# Altium project PCB_Project.PrjPcb (part 2 of 3)

## Sheet MC60.SchDoc
size A2; SheetNumber: 5; SheetTotal: 8
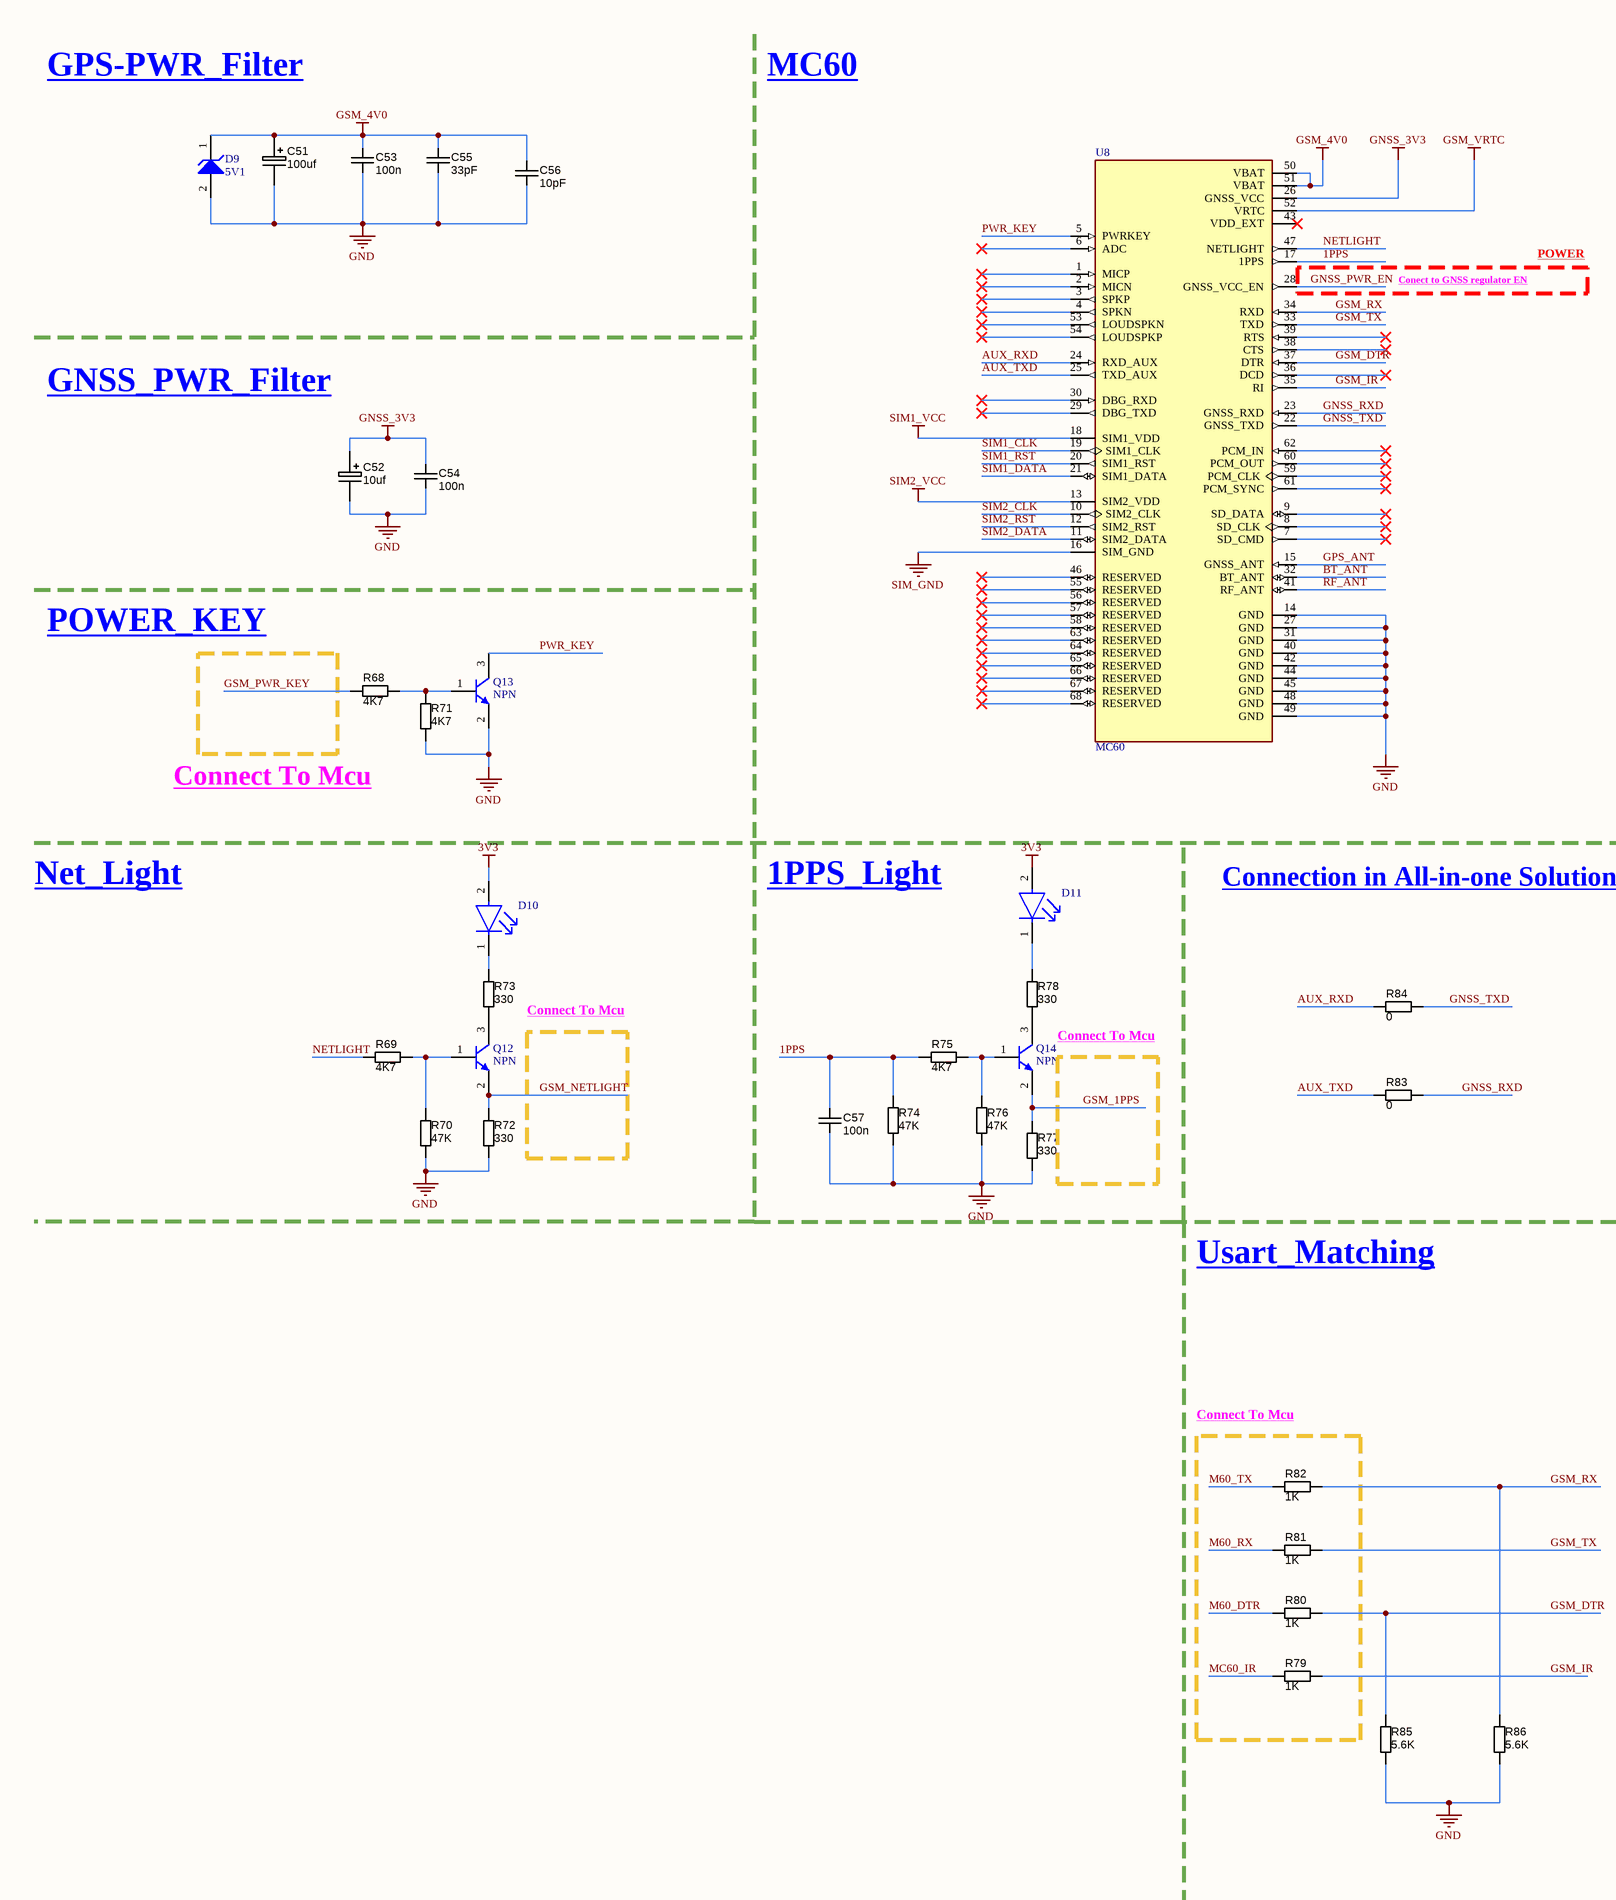
[diagram p4: MC60.SchDoc, left]
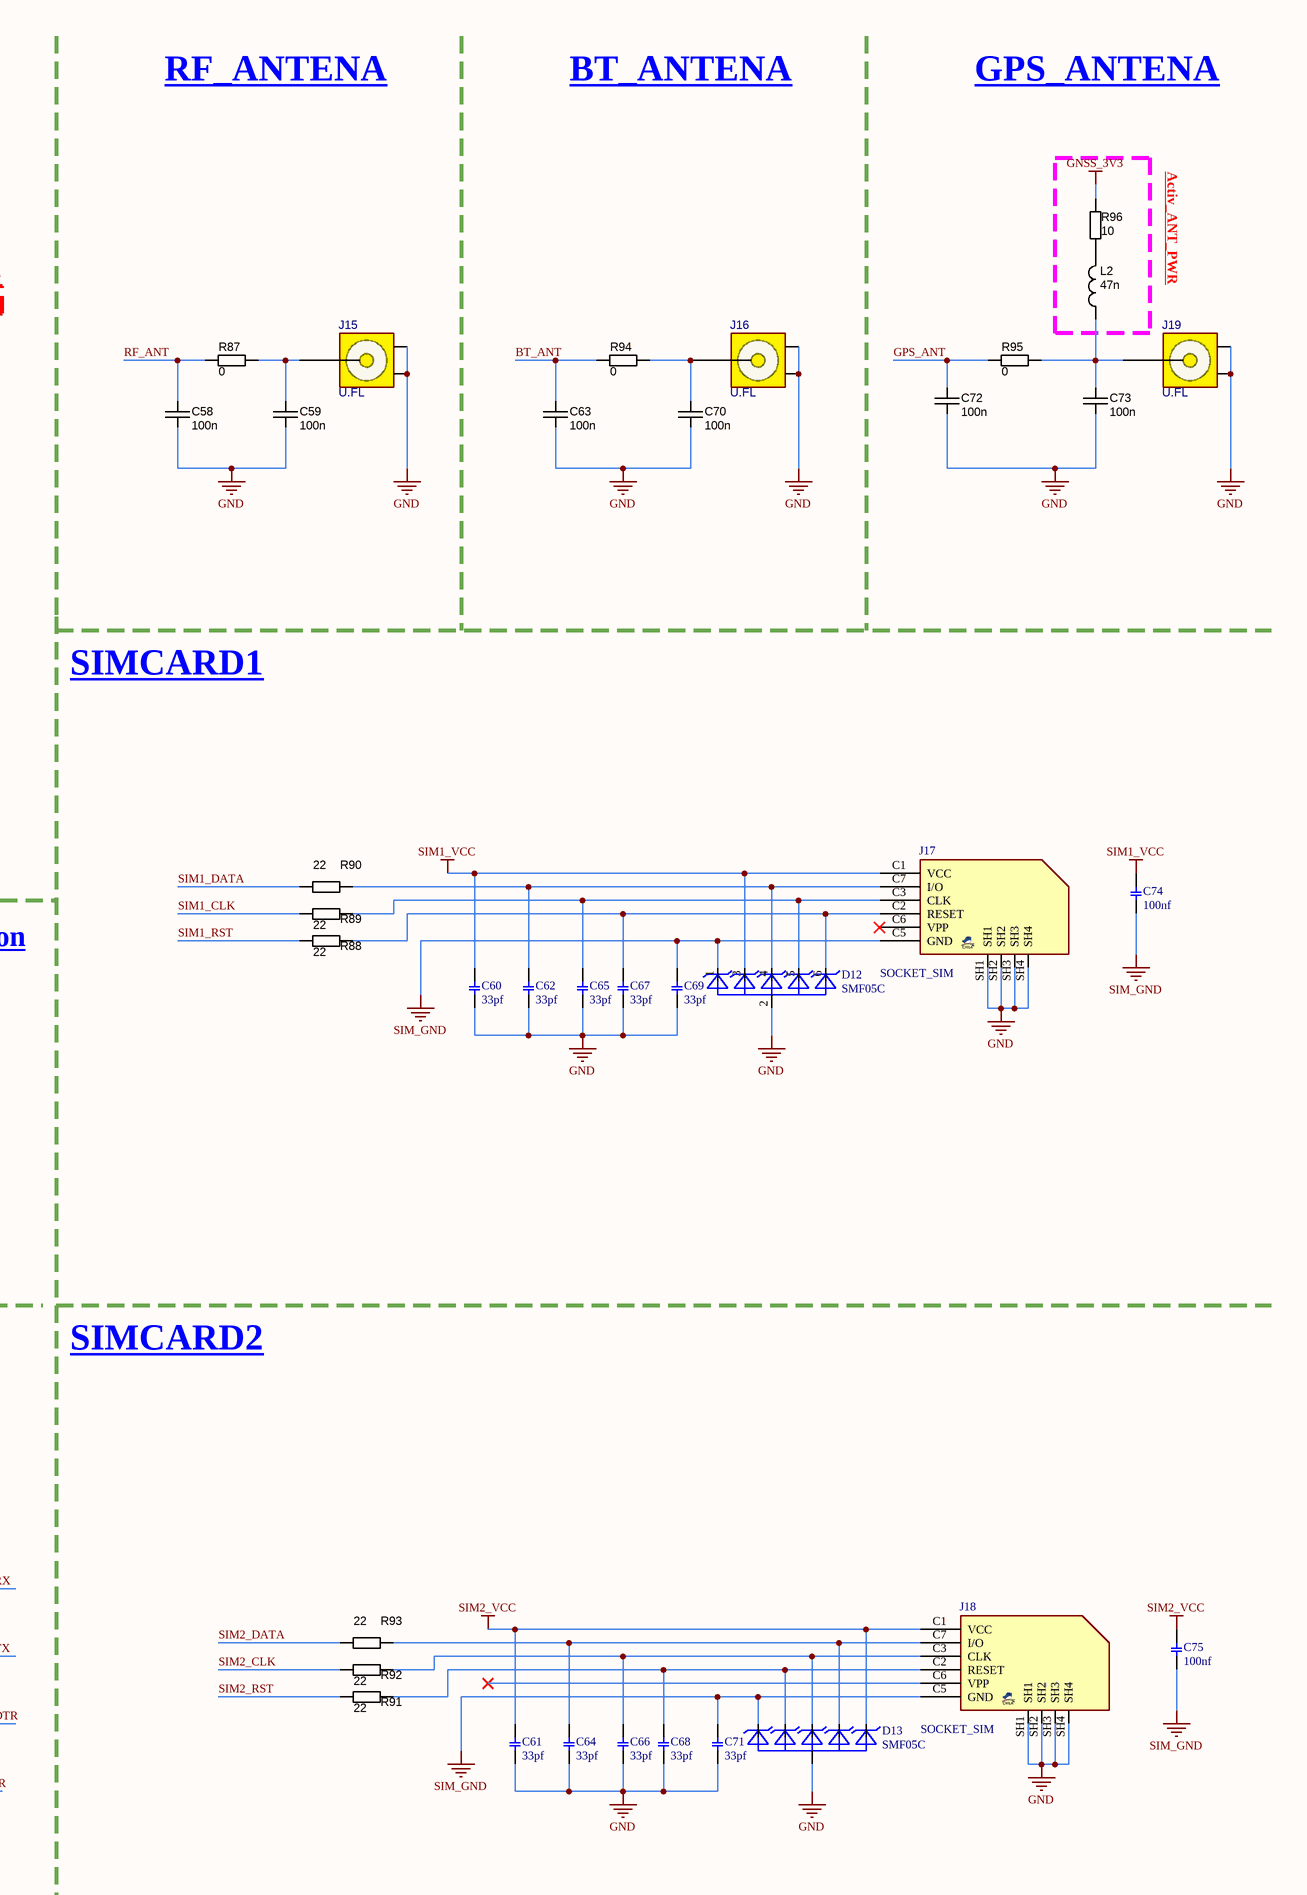
[diagram p5: MC60.SchDoc, right]

### Parts
C51  value 100uf  [C_TN_3528]
C52  value 10uf  [C_TN_3528]
C53  value 100n  [CAPC1608X90N]  (hidden comment: approved sub OK)
C54  value 100n  [CAPC1608X90N]  (hidden comment: approved sub OK)
C55  value 33pF  [CAPC1608X90N]  (hidden comment: approved sub OK)
C56  value 10pF  [CAPC1608X90N]  (hidden comment: approved sub OK)
C57  value 100n  [CAPC1608X90N]  (hidden comment: approved sub OK)
C58  value 100n  [C0402]  (hidden comment: approved sub OK)
C59  value 100n  [C0402]  (hidden comment: approved sub OK)
C60  value 33pf  [0603]  (hidden comment: Capacitor C SMD 0603)
C61  value 33pf  [0603]  (hidden comment: Capacitor C SMD 0603)
C62  value 33pf  [0603]  (hidden comment: Capacitor C SMD 0603)
C63  value 100n  [C0402]  (hidden comment: approved sub OK)
C64  value 33pf  [0603]  (hidden comment: Capacitor C SMD 0603)
C65  value 33pf  [0603]  (hidden comment: Capacitor C SMD 0603)
C66  value 33pf  [0603]  (hidden comment: Capacitor C SMD 0603)
C67  value 33pf  [0603]  (hidden comment: Capacitor C SMD 0603)
C68  value 33pf  [0603]  (hidden comment: Capacitor C SMD 0603)
C69  value 33pf  [0603]  (hidden comment: Capacitor C SMD 0603)
C70  value 100n  [C0402]  (hidden comment: approved sub OK)
C71  value 33pf  [0603]  (hidden comment: Capacitor C SMD 0603)
C72  value 100n  [C0402]  (hidden comment: approved sub OK)
C73  value 100n  [C0402]  (hidden comment: approved sub OK)
C74  value 100nf  [0603]  (hidden comment: Capacitor C SMD 0603)
C75  value 100nf  [0603]  (hidden comment: Capacitor C SMD 0603)
D9  5V1  [ONSC-SMA-2-403D-02_F_V]
D10  LTST-C191TBKT  [FP-LTST-C191TBKT-MFG]  (value not drawn)
D11  LTST-C191TBKT  [FP-LTST-C191TBKT-MFG]  (value not drawn)
D12  SMF05C  [SC70-6]
D13  SMF05C  [SC70-6]
J15  U.FL  [UFL]
J16  U.FL  [UFL]
J17  SOCKET_SIM  [SIM_MICRO_GCT]
J18  SOCKET_SIM  [SIM_MICRO_GCT]
J19  U.FL  [UFL]
L2  47n  [L0603]
Q12  NPN  [SOT23-3]
Q13  NPN  [SOT23-3]
Q14  NPN  [SOT23-3]
R68  value 4K7  [RESC1608X55N]  (hidden comment: Thick Film)
R69  value 4K7  [RESC1608X55N]  (hidden comment: Thick Film)
R70  value 47K  [RESC1608X55N]  (hidden comment: Thick Film)
R71  value 4K7  [RESC1608X55N]  (hidden comment: Thick Film)
R72  value 330  [RESC1608X55N]  (hidden comment: Thick Film)
R73  value 330  [RESC1608X55N]  (hidden comment: Thick Film)
R74  value 47K  [RESC1608X55N]  (hidden comment: Thick Film)
R75  value 4K7  [RESC1608X55N]  (hidden comment: Thick Film)
R76  value 47K  [RESC1608X55N]  (hidden comment: Thick Film)
R77  value 330  [RESC1608X55N]  (hidden comment: Thick Film)
R78  value 330  [RESC1608X55N]  (hidden comment: Thick Film)
R79  value 1K  [RESC1608X55N]  (hidden comment: Thick Film)
R80  value 1K  [RESC1608X55N]  (hidden comment: Thick Film)
R81  value 1K  [RESC1608X55N]  (hidden comment: Thick Film)
R82  value 1K  [RESC1608X55N]  (hidden comment: Thick Film)
R83  value 0  [RESC1608X55N]  (hidden comment: Thick Film)
R84  value 0  [RESC1608X55N]  (hidden comment: Thick Film)
R85  value 5.6K  [RESC1608X55N]  (hidden comment: Thick Film)
R86  value 5.6K  [RESC1608X55N]  (hidden comment: Thick Film)
R87  value 0  [0402]  (hidden comment: Thick Film)
R88  value 22  [RESC1608X55N]  (hidden comment: Thick Film)
R89  value 22  [RESC1608X55N]  (hidden comment: Thick Film)
R90  value 22  [RESC1608X55N]  (hidden comment: Thick Film)
R91  value 22  [RESC1608X55N]  (hidden comment: Thick Film)
R92  value 22  [RESC1608X55N]  (hidden comment: Thick Film)
R93  value 22  [RESC1608X55N]  (hidden comment: Thick Film)
R94  value 0  [0402]  (hidden comment: Thick Film)
R95  value 0  [0402]  (hidden comment: Thick Film)
R96  value 10  [0402]  (hidden comment: Thick Film)
U8  MC60  [XCVR_MC60]

### Blocks framed on the sheet
Connect To Mcu: R79-R82

### Nets
3V3: D10.2(A) D11.2(A)
GND: C51.2 C52.2 C53.2 C54.2 C55.2 C56.2 C57.2 C58.2 C59.2 C60.1 C61.1 C62.1 C63.2 C64.1 C65.1 C66.1 C67.1 C68.1 C69.1 C70.2 C71.1 C72.2 C73.2 D9.2(A) D12.2(A) D13.2(A) J15.2(G1) J15.3(G2) J16.2(G1) J16.3(G2) J17.SH1 J17.SH2 J17.SH3 J17.SH4 J18.SH1 J18.SH2 J18.SH3 J18.SH4 J19.2(G1) J19.3(G2) Q13.2(E) R70.2 R71.2 R72.2 R74.2 R76.2 R77.2 R85.2 R86.2 U8.14(GND) U8.27(GND) U8.31(GND) U8.40(GND) U8.42(GND) U8.44(GND) U8.45(GND) U8.48(GND) U8.49(GND)
GNSS_3V3: C52.1 C54.1 R96.1 U8.26(GNSS_VCC)
GSM_4V0: C51.1 C53.1 C55.1 C56.1 D9.1(K) U8.50(VBAT) U8.51(VBAT)
GSM_VRTC: U8.52(VRTC)
SIM1_VCC: C60.2 C74.2 D12.3(C2) J17.C1(VCC) U8.18(SIM1_VDD)
SIM2_VCC: C61.2 C75.2 D13.6(C5) J18.C1(VCC) U8.13(SIM2_VDD)
SIM_GND: C69.2 C71.2 C74.1 C75.1 D12.1(C1) D13.1(C1) J17.C5(GND) J18.C5(GND) U8.16(SIM_GND)
1PPS: C57.1 R74.1 R75.1 U8.17(1PPS)
AUX_RXD: R84.2 U8.24(RXD_AUX)
AUX_TXD: R83.2 U8.25(TXD_AUX)
BT_ANT: C63.1 R94.2 U8.32(BT_ANT)
GNSS_PWR_EN: U8.28(GNSS_VCC_EN)
GNSS_RXD: R83.1 U8.23(GNSS_RXD)
GNSS_TXD: R84.1 U8.22(GNSS_TXD)
GPS_ANT: C72.1 R95.2 U8.15(GNSS_ANT)
GSM_1PPS: Q14.2(E) R77.1
GSM_DTR: R80.1 R85.1 U8.37(DTR)
GSM_IR: R79.1 U8.35(RI)
GSM_NETLIGHT: Q12.2(E) R72.1
GSM_PWR_KEY: R68.2
GSM_RX: R82.1 R86.1 U8.34(RXD)
GSM_TX: R81.1 U8.33(TXD)
M60_DTR: R80.2
M60_RX: R81.2
M60_TX: R82.2
MC60_IR: R79.2
NETLIGHT: R69.1 U8.47(NETLIGHT)
PWR_KEY: Q13.3(C) U8.5(PWRKEY)
RF_ANT: C58.1 R87.2 U8.41(RF_ANT)
SIM1_CLK: R89.1 U8.19(SIM1_CLK)
SIM1_DATA: R90.1 U8.21(SIM1_DATA)
SIM1_RST: R88.1 U8.20(SIM1_RST)
SIM2_CLK: R92.1 U8.10(SIM2_CLK)
SIM2_DATA: R93.1 U8.11(SIM2_DATA)
SIM2_RST: R91.1 U8.12(SIM2_RST)
NetC59_1: C59.1 J15.1(SIG) R87.1
NetC62_2: C62.2 D12.4(C3) J17.C7(I/O) R90.2
NetC64_2: C64.2 D13.5(C4) J18.C7(I/O) R93.2
NetC65_2: C65.2 D12.5(C4) J17.C3(CLK) R89.2
NetC66_2: C66.2 D13.4(C3) J18.C3(CLK) R92.2
NetC67_2: C67.2 D12.6(C5) J17.C2(RESET) R88.2
NetC68_2: C68.2 D13.3(C2) J18.C2(RESET) R91.2
NetC70_1: C70.1 J16.1(SIG) R94.1
NetC73_1: C73.1 J19.1(SIG) L2.1 R95.1
NetD10_1: D10.1(C) R73.1
NetD11_1: D11.1(C) R78.1
NetL2_2: L2.2 R96.2
NetQ12_1: Q12.1(B) R69.2 R70.1
NetQ12_3: Q12.3(C) R73.2
NetQ13_1: Q13.1(B) R68.1 R71.1
NetQ14_1: Q14.1(B) R75.2 R76.1
NetQ14_3: Q14.3(C) R78.2

Not connected (* = marked no-connect by the designer): J17 C6(VPP)*; J18 C6(VPP)*; U8 1(MICP)* 2(MICN)* 3(SPKP)* 4(SPKN)* 6(ADC)* 7(SD_CMD)* 8(SD_CLK)* 9(SD_DATA)* 29(DBG_TXD)* 30(DBG_RXD)* 36(DCD)* 38(CTS)* 39(RTS)* 43(VDD_EXT)* 46(RESERVED)* 53(LOUDSPKN)* 54(LOUDSPKP)* 55(RESERVED)* 56(RESERVED)* 57(RESERVED)* 58(RESERVED)* 59(PCM_CLK)* 60(PCM_OUT)* 61(PCM_SYNC)* 62(PCM_IN)* 63(RESERVED)* 64(RESERVED)* 65(RESERVED)* 66(RESERVED)* 67(RESERVED)* 68(RESERVED)*

### Notes on the sheet
- GPS-PWR_Filter
- MC60
- RF_ANTENA
- BT_ANTENA
- GPS_ANTENA
- Activ_ANT_PWR
- Conect to GNSS regulator EN
- POWER
- GNSS_PWR_Filter
- POWER_KEY
- SIMCARD1
- Connect To Mcu
- Net_Light
- 1PPS_Light
- Connection in All-in-one Solution
- Usart_Matching
- SIMCARD2

### Library data of the parts
C51 = CAPT_4u7_3216_16V: Capacitor SMD Tantalum 100uF 10% 16V 3216-18; Manufacturer 1: Vishay/Sprague; Manufacturer Part Number 1: 293D475X9016A2TE3; SCDType: undef; Package / Case: EIA 535BAAC size A; Ratings: 16V; Tolerance: ±10%; Material: Tantalum; Supplier 1: Digi-Key; Supplier Part Number 1: 718-1148-1-ND
C52 = CAPT_4u7_3216_16V: Capacitor SMD Tantalum 10uF 10% 16V 3216-18; Manufacturer 1: Vishay/Sprague; Manufacturer Part Number 1: 293D475X9016A2TE3; SCDType: undef; Package / Case: EIA 535BAAC size A; Ratings: 16V; Tolerance: ±10%; Material: Tantalum; Supplier 1: Digi-Key; Supplier Part Number 1: 718-1148-1-ND
C53 C54 C57-C59 C63 C70 C72 C73 = CAPC_100n_0603_X7R_50V_10%: Capacitor SMD Cer 100nF 10% 50V X7R 0603; Manufacturer 1: AVX Corporation; Manufacturer Part Number 1: 06035C104KAT2A; Ratings: 50V; X7R; Material: ceramic; SCDType: spec; Manufacturer 2: TDK Corporation; Manufacturer Part Number 2: C1608X7R1H104K; Package / Case: 0603 (1608 Metric); Tolerance: ±10%; Supplier 1: Digi-Key; Supplier Part Number 1: 478-5052-1-ND; ComponentLink1URL: http://www.avx.com/docs/Catalogs/cx7r.pdf; ComponentLink1Description: http://www.avx.com/docs/Catalogs/cx7r.pdf; Supplier 2: Digi-Key; Supplier Part Number 2: 445-1314-1-ND; ComponentLink2URL: http://product.tdk.com/capacitor/mlcc/en/documents/mlcc_commercial_general_en.pdf; ComponentLink2Description: http://product.tdk.com/capacitor/mlcc/en/documents/mlcc_commercial_general_en.pdf
C55 = CAPC_100n_0603_X7R_50V_10%: Capacitor SMD Cer 33pF10% 50V X7R 0603; Manufacturer 1: AVX Corporation; Manufacturer Part Number 1: 06035C104KAT2A; Tolerance: ±10%; Ratings: 50V; X7R; Material: ceramic; SCDType: spec; Manufacturer 2: TDK Corporation; Manufacturer Part Number 2: C1608X7R1H104K; Package / Case: 0603 (1608 Metric); Supplier 1: Digi-Key; Supplier Part Number 1: 478-5052-1-ND; ComponentLink1URL: http://www.avx.com/docs/Catalogs/cx7r.pdf; ComponentLink1Description: http://www.avx.com/docs/Catalogs/cx7r.pdf; Supplier 2: Digi-Key; Supplier Part Number 2: 445-1314-1-ND; ComponentLink2URL: http://product.tdk.com/capacitor/mlcc/en/documents/mlcc_commercial_general_en.pdf; ComponentLink2Description: http://product.tdk.com/capacitor/mlcc/en/documents/mlcc_commercial_general_en.pdf
C56 = CAPC_100n_0603_X7R_50V_10%: Capacitor SMD Cer 10pF10% 50V X7R 0603; Manufacturer 1: AVX Corporation; Manufacturer Part Number 1: 06035C104KAT2A; Tolerance: ±10%; Ratings: 50V; X7R; Material: ceramic; SCDType: spec; Manufacturer 2: TDK Corporation; Manufacturer Part Number 2: C1608X7R1H104K; Package / Case: 0603 (1608 Metric); Supplier 1: Digi-Key; Supplier Part Number 1: 478-5052-1-ND; ComponentLink1URL: http://www.avx.com/docs/Catalogs/cx7r.pdf; ComponentLink1Description: http://www.avx.com/docs/Catalogs/cx7r.pdf; Supplier 2: Digi-Key; Supplier Part Number 2: 445-1314-1-ND; ComponentLink2URL: http://product.tdk.com/capacitor/mlcc/en/documents/mlcc_commercial_general_en.pdf; ComponentLink2Description: http://product.tdk.com/capacitor/mlcc/en/documents/mlcc_commercial_general_en.pdf
D9 = CMP-1060-00099-1: 1.5 W Zener Voltage Regulator, 2-Pin SMA, Pb-Free, Tape and Reel; Manufacturer: On Semiconductor; PartNumber: 1SMA5939BT3G; VZ Typ (V): 39; Packing: Tape and Reel; ComponentLink2URL: http://www.onsemi.com/pub_link/Collateral/1SMA5913BT3-D.PDF; ComponentLink3URL: http://www.onsemi.com/pub_link/Collateral/1SMA5913BT3-D.PDF; ComponentLink3Description: Package Specification; RoHS: Pb-Free; ComponentLink2Description: Datasheet; PackageReference: SMA-2-403D-02_F; ComponentLink1URL: http://www.onsemi.com/; PackageVersion: Rev. F, 11/2008; ComponentLink1Description: Manufacturer URL; Mounting Technology: Surface Mount; DatasheetVersion: Rev. 8; PackageDescription: 2-Pin Small Molded Package, J-Bend Lead, Body 2.605 x 4.315 mm
D10 D11 = CMP-22017-000008-1: LED BLUE CLEAR CHIP SMD; Lens Color: Colorless; Dominant Wavelength: 475nm; Forward Current: 20mA; Wavelength: 468nm; Viewing Angle: 130°; Power Dissipation: 76mW; Luminous Intensity: 180mcd; Reverse Voltage: 5V; Number of Elements: 1; Lens Style: Diffused; Forward Voltage: 3.8V; Max Power Dissipation: 75mW; Case Code (Metric): 1608; Packaging: Tape and Reel; Case/Package: 0603; Depth: 1.6mm; Mount: Surface Mount; Lead Free: Lead Free; Min Operating Temperature: -20°C; Lens Transparency: Clear; Illumination Color: Blue; Height: 0.55mm; Test Current: 20mA; Case Code (Imperial): 0603; Max Operating Temperature: 80°C; Number of Pins: 2; Length: 0.8mm; Radiation Hardening: No; Package Quantity: 1; Number of LEDs: 1; Width: 0.8mm; Color: Blue
D12 D13 = SMF05C: 12.5V Clamp 8A _8/20Âµs_ Ipp Tvs Diode Surface Mount SC-88/SC70-6/SOT-363; MF: ON Semiconductor; Availability: Unavailable; Price: None; Package: SOT-363 ON Semiconductor; Value: *; SnapEDA_Link: https://www.snapeda.com/parts/SMF05C/ON%20Semiconductor/view-part/2782704/?ref=snap; MP: SMF05C
J15 J16 J19 = CONN_RF_UFL: CONN, RF, U.FL, STRAIGHT, Ultra Miniature Coaxial; MANF_P#: CONUFL001-SMD, U.FL-R-SMT-1(10), 128-0711-201; MANF: Linx, Hirose, Cinch; PARAM: 50Ohm, 6GHz; DESC: DESCRIPTION; DIST#: DIGIKEY, MOUSER; PARAM2: GOLD; ASSEMBLY: ASSEMBLY; PRICE: 0.9$; VALUE: U.FL
J17 J18 = SIM_MICRO_6: SOCKET, SIM MICRO; MANF: -; PRICE: 3t@Lion Iran; MANF_P#: -; DESC: -; VALUE: SOCKET_SIM
L2 = INDC_10u_LowRDC: Inductor SMD Low DCR 47 nH 900mA 20% 1210; Manufacturer 1: Taiyo Yuden; Manufacturer Part Number 1: CBC3225T100MR; Ratings: 900 mA; 133 mOhm; DC Resistance (DCR): 172.9 mOhm Max; Frequency - Self Resonant: 23MHz; Frequency - Test: 100kHz; SCDType: spec; Tolerance: ±20%; Supplier 1: Digi-Key; Supplier Part Number 1: 587-1625-1-ND; Current: 900mA; Current - Saturation: 900mA; Current - Temperature Rise: 900mA; Applications: Power Supplies; Package / Case: 1210 (3225 Metric); Operating Temperature: -40°C ~ 105°C; ComponentLink1URL: http://www.yuden.co.jp/ut/product/pdf/wound02_e.pdf; ComponentLink1Description: http://www.yuden.co.jp/ut/product/pdf/wound02_e.pdf; Value: 47n
Q12-Q14 = NPN: NPN Bipolar Transistor; Published: 8-Jun-2000; LatestRevisionDate: 17-Jul-2002; LatestRevisionNote: Re-released for DXP Platform.; PackageReference: TO-226-AA; Publisher: Altium Limited; PackageDescription: TO, Flat Index; 3 In-Line, Axial Leads; Body Dia. 4.8mm; Leads 0.55 x 0.51 mm (max); Code_JEDEC: TO-226-AA
R68 R69 R71 R75 = RES_4K7_0603_5%: Resistor SMD chip 4.7k Ohm 0.1W 5% 0603; Manufacturer 1: Vishay/Dale; Manufacturer Part Number 1: CRCW06034K70JNEA; Ratings: 1/10 W; SCDType: spec; Package / Case: 0603 (1608 metric); Tolerance: ±5%; Material: Thick Film; Supplier 1: Digi-Key; Supplier Part Number 1: 541-4.7KGCT-ND
R70 R74 R76 = RES_4K7_0603_5%: Resistor SMD chip 47K Ohm 0.1W 5% 0603; Manufacturer 1: Vishay/Dale; Manufacturer Part Number 1: CRCW06034K70JNEA; Ratings: 1/10 W; SCDType: spec; Package / Case: 0603 (1608 metric); Tolerance: ±5%; Material: Thick Film; Supplier 1: Digi-Key; Supplier Part Number 1: 541-4.7KGCT-ND
R72 R73 R77 R78 = RES_4K7_0603_5%: Resistor SMD chip 330 Ohm 0.1W 5% 0603; Manufacturer 1: Vishay/Dale; Manufacturer Part Number 1: CRCW06034K70JNEA; Ratings: 1/10 W; SCDType: spec; Package / Case: 0603 (1608 metric); Tolerance: ±5%; Material: Thick Film; Supplier 1: Digi-Key; Supplier Part Number 1: 541-4.7KGCT-ND
R79-R82 = RES_4K7_0603_5%: Resistor SMD chip 1K Ohm 0.1W 5% 0603; Manufacturer 1: Vishay/Dale; Manufacturer Part Number 1: CRCW06034K70JNEA; Ratings: 1/10 W; SCDType: spec; Package / Case: 0603 (1608 metric); Tolerance: ±5%; Material: Thick Film; Supplier 1: Digi-Key; Supplier Part Number 1: 541-4.7KGCT-ND
R83 R84 R87 R94 R95 = RES_4K7_0603_5%: Resistor SMD chip 0 Ohm 0.1W 5% 0603; Manufacturer 1: Vishay/Dale; Manufacturer Part Number 1: CRCW06034K70JNEA; Ratings: 1/10 W; SCDType: spec; Package / Case: 0603 (1608 metric); Tolerance: ±5%; Material: Thick Film; Supplier 1: Digi-Key; Supplier Part Number 1: 541-4.7KGCT-ND
R85 R86 = RES_4K7_0603_5%: Resistor SMD chip 5.6K Ohm 0.1W 5% 0603; Manufacturer 1: Vishay/Dale; Manufacturer Part Number 1: CRCW06034K70JNEA; Ratings: 1/10 W; SCDType: spec; Package / Case: 0603 (1608 metric); Tolerance: ±5%; Material: Thick Film; Supplier 1: Digi-Key; Supplier Part Number 1: 541-4.7KGCT-ND
R88-R93 = RES_4K7_0603_5%: Resistor SMD chip 22 Ohm 0.1W 5% 0603; Manufacturer 1: Vishay/Dale; Manufacturer Part Number 1: CRCW06034K70JNEA; Ratings: 1/10 W; SCDType: spec; Package / Case: 0603 (1608 metric); Tolerance: ±5%; Material: Thick Film; Supplier 1: Digi-Key; Supplier Part Number 1: 541-4.7KGCT-ND
R96 = RES_4K7_0603_5%: Resistor SMD chip 10 Ohm 0.1W 5% 0603; Manufacturer 1: Vishay/Dale; Manufacturer Part Number 1: CRCW06034K70JNEA; Ratings: 1/10 W; SCDType: spec; Package / Case: 0603 (1608 metric); Tolerance: ±5%; Material: Thick Film; Supplier 1: Digi-Key; Supplier Part Number 1: 541-4.7KGCT-ND
U8 = MC60: MC60 is a quad-band full-featured 2G GSM/GPRS module using LCC castellation package. With an extensive set of Internet protocols _TCP, UDP, PPP, FTP, HTTP and SSL_, it has integrated the GNSS technology for satellite navigation; MF: Quectel; Value: *; Price: None; Package: DIP-8 Quectel; SnapEDA_Link: https://www.snapeda.com/parts/MC60/Quectel/view-part/4388480/?ref=snap; Availability: Unavailable; MP: MC60
C60-C62 C64-C69 C71 C74 C75 = Capacitor C SMD 0603: DatasheetVersion: 2021; ComponentLink1Description: Website Smart World; ComponentLink1URL: https://www.smartw.ir/; ComponentLink2Description: Telegram; ComponentLink2URL: https://t.me/altium_smartw; ComponentLink3Description: Instagram; ComponentLink3URL: https://Instagram.com/smartgw.ir

## Sheet Power.SchDoc
size A3; SheetNumber: 6; SheetTotal: 8
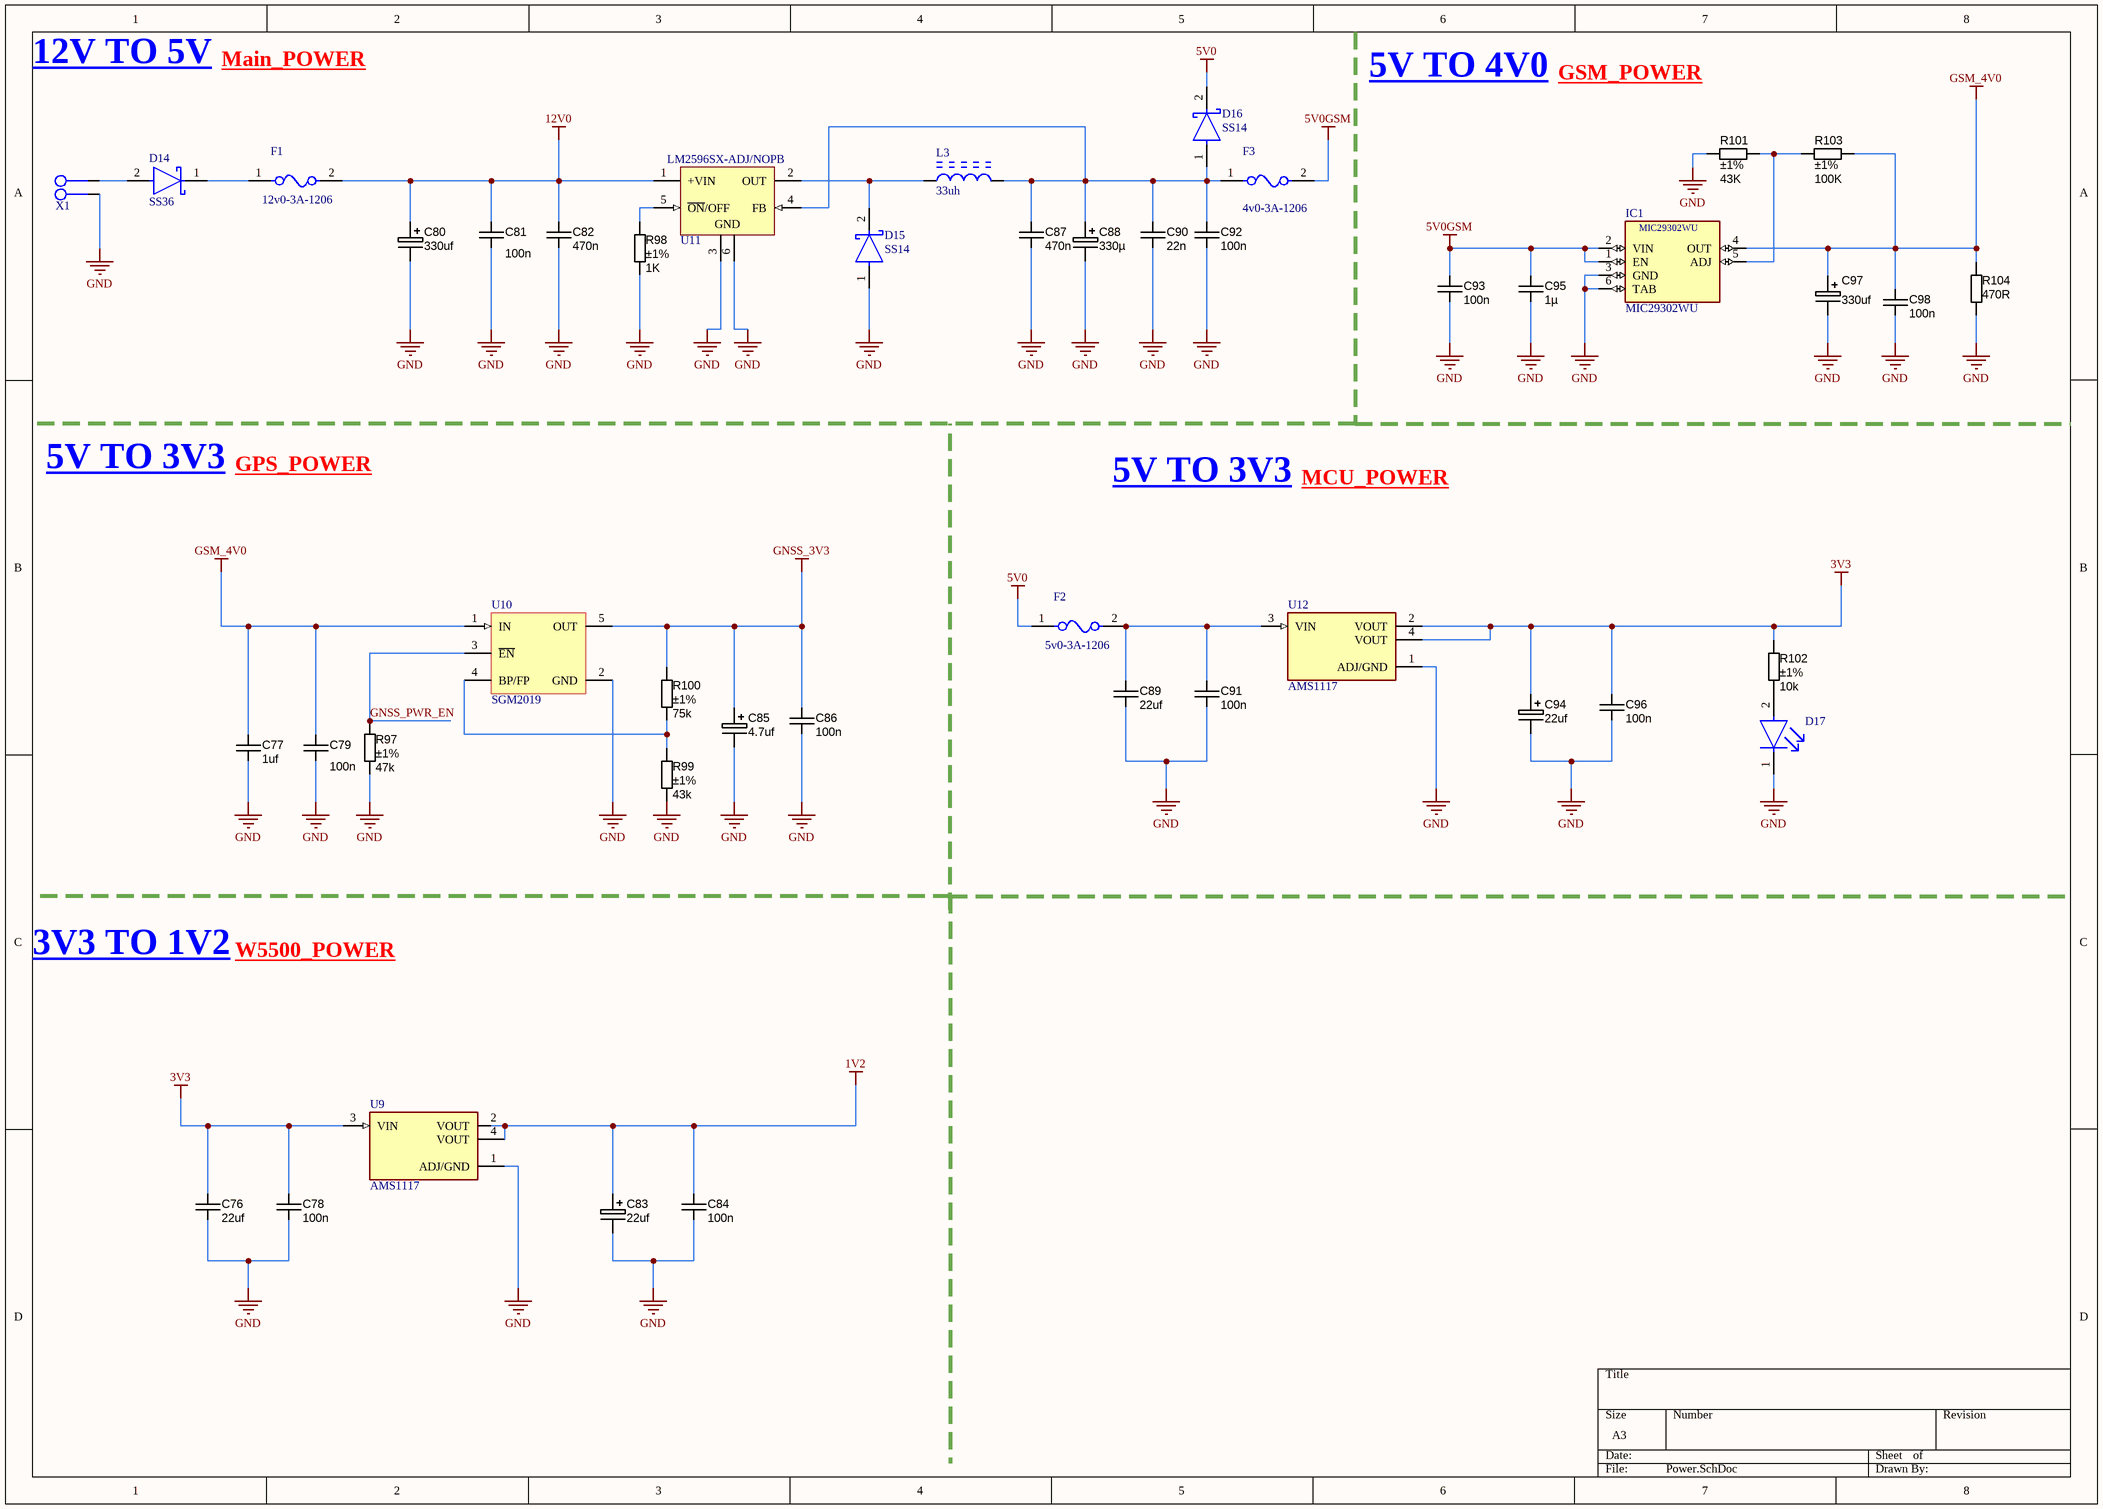
[diagram p6: Power.SchDoc]

### Parts
C76  22uf  [CAPC1608X90N]
C77  1uf  [CAPC1608X90N]
C78  value 100n  [CAPC1608X90N]  (hidden comment: approved sub OK)
C79  100n  [CAPC1608X90N]
C80  330uf  [C_EL_8]
C81  100n  [CAPC1608X90N]
C82  value 470n  [CAPC3216X180N]  (hidden comment: approved sub OK)
C83  22uf  [C_TN_3216]
C84  value 100n  [CAPC1608X90N]  (hidden comment: approved sub OK)
C85  4.7uf  [C_TN_3216]
C86  value 100n  [CAPC1608X90N]  (hidden comment: approved sub OK)
C87  value 470n  [CAPC3216X180N]  (hidden comment: approved sub OK)
C88  330µ  [C_TN_7343]
C89  22uf  [CAPC1608X90N]
C90  22n  [CAPC1608X90N]
C91  value 100n  [CAPC1608X90N]  (hidden comment: approved sub OK)
C92  100n  [CAPC1608X90N]
C93  value 100n  [CAPC1608X90N]  (hidden comment: approved sub OK)
C94  22uf  [C_TN_3216]
C95  value 1µ  [CAPC3216X180N]  (hidden comment: approved sub OK)
C96  value 100n  [CAPC1608X90N]  (hidden comment: approved sub OK)
C97  330uf  [C_EL_8]
C98  value 100n  [CAPC1608X90N]  (hidden comment: approved sub OK)
D14  SS36  [FP-403AG-MFG]
D15  SS14  [FP-403AE-MFG]
D16  SS14  [FP-403AE-MFG]
D17  LTST-C191TBKT  [FP-LTST-C191TBKT-MFG]  (value not drawn)
F1  12v0-3A-1206  [FP-nanoSMDC-MFG]
F2  5v0-3A-1206  [FP-nanoSMDC-MFG]
F3  4v0-3A-1206  [FP-nanoSMDC-MFG]
IC1  MIC29302WU  [TO263-5]
L3  33uh  [BOUR-SRR1280-2_V]
R97  value 47k  Tolerance: ±1%  [RESC1608X55N]  (hidden comment: Thick Film)
R98  value 1K  Tolerance: ±1%  [RESC1608X55N]  (hidden comment: Thick Film)
R99  value 43k  Tolerance: ±1%  [RESC1608X55N]  (hidden comment: Thick Film)
R100  value 75k  Tolerance: ±1%  [RESC1608X55N]  (hidden comment: Thick Film)
R101  value 43K  Tolerance: ±1%  [RESC1608X55N]  (hidden comment: Thick Film)
R102  value 10k  Tolerance: ±1%  [RESC1608X55N]  (hidden comment: Thick Film)
R103  value 100K  Tolerance: ±1%  [RESC1608X55N]  (hidden comment: Thick Film)
R104  value 470R  [RESC3216X70N]  (hidden comment: Thick Film)
U9  AMS1117  [SOT223]
U10  SGM2019  [SOT95P280X100-5N]
U11  LM2596SX-ADJ/NOPB  [KTT0005B_L]
U12  AMS1117  [SOT223]
X1  Phoenix MKDSN 02  [PRKR2A]  (value not drawn)

### Nets
1V2: C83.1 C84.1 U9.2(VOUT) U9.4(VOUT)
3V3: C76.1 C78.1 C94.1 C96.1 R102.1 U9.3(VIN) U12.2(VOUT) U12.4(VOUT)
5V0: D16.2(C) F2.1
5V0GSM: C93.1 C95.1 F3.2 IC1.1(EN) IC1.2(VIN)
12V0: C80.1 C81.1 C82.1 F1.2 U11.1(+VIN)
GND: C76.2 C77.2 C78.2 C79.2 C80.2 C81.2 C82.2 C83.2 C84.2 C85.2 C86.2 C87.2 C88.2 C89.2 C90.2 C91.2 C92.2 C93.2 C94.2 C95.2 C96.2 C97.2 C98.2 D15.1(A) D17.1(C) IC1.3(GND) IC1.6(TAB) R97.2 R98.2 R99.2 R101.1 R104.2 U9.1(ADJ/GND) U10.2(GND) U11.3(GND) U11.6(GND) U12.1(ADJ/GND) X1.1
GNSS_3V3: C85.1 C86.1 R100.1 U10.5(OUT)
GSM_4V0: C77.1 C79.1 C97.1 C98.1 IC1.4(OUT) R103.2 R104.1 U10.1(IN)
GNSS_PWR_EN: R97.1 U10.3(~{EN})
NetC87_1: C87.1 C88.1 C90.1 C92.1 D16.1(A) F3.1 L3.2 U11.4(FB)
NetC89_1: C89.1 C91.1 F2.2 U12.3(VIN)
NetD14_1: D14.1(C) F1.1
NetD14_2: D14.2(A) X1.2
NetD15_2: D15.2(C) L3.1 U11.2(OUT)
NetD17_2: D17.2(A) R102.2
NetIC1_5: IC1.5(ADJ) R101.2 R103.1
NetR98_1: R98.1 U11.5(~{ON}/OFF)
NetR99_1: R99.1 R100.2 U10.4(BP/FP)

### Notes on the sheet
- 12V TO 5V
- Main_POWER
- 5V TO 4V0
- GSM_POWER
- 5V TO 3V3
- GPS_POWER
- MCU_POWER
- 3V3 TO 1V2
- W5500_POWER

### Library data of the parts
C76 C89 = CAPC_470n_0603_X7R_16V_10%: Capacitor SMD Cer 22uf 10% 16V X7R 0603; Manufacturer 1: Murata Electronics North America; Manufacturer Part Number 1: GRM188R71C474KA88D; Ratings: 16V; X7R; Material: ceramic; SCDType: spec; Package / Case: 0603 (1608 metric); Tolerance: ±10%; Manufacturer 2: TDK Corporation; Manufacturer Part Number 2: C1608X7R1C474K; Supplier 1: Digi-Key; Supplier Part Number 1: 490-3295-2-ND; Supplier 2: Digi-Key; Supplier Part Number 2: 445-5192-2-ND; Supplier 3: Digi-Key; Supplier Part Number 3: 587-1250-2-ND; Manufacturer 3: Taiyo Yuden; Manufacturer Part Number 3: EMK107B7474KA-T; Manufacturer 4: Samsung; Manufacturer Part Number 4: CL10B474KONE; ComponentLink1URL: http://psearch.murata.com/capacitor/product/GRM188R71C474KA88#.pdf; ComponentLink1Description: http://psearch.murata.com/capacitor/product/GRM188R71C474KA88#.pdf; ComponentLink2URL: http://product.tdk.com/capacitor/mlcc/en/documents/mlcc_commercial_general_en.pdf; ComponentLink2Description: http://product.tdk.com/capacitor/mlcc/en/documents/mlcc_commercial_general_en.pdf; ComponentLink3URL: http://www.yuden.co.jp/or/product/category/capacitor/EMK107B7474KA-T.pdf; ComponentLink3Description: http://www.yuden.co.jp/or/product/category/capacitor/EMK107B7474KA-T.pdf; Value: 22uf
C77 = CAPC_470n_0603_X7R_16V_10%: Capacitor SMD Cer 1uf 10% 16V X7R 0603; Manufacturer 1: Murata Electronics North America; Manufacturer Part Number 1: GRM188R71C474KA88D; Ratings: 16V; X7R; Material: ceramic; SCDType: spec; Package / Case: 0603 (1608 metric); Tolerance: ±10%; Manufacturer 2: TDK Corporation; Manufacturer Part Number 2: C1608X7R1C474K; Supplier 1: Digi-Key; Supplier Part Number 1: 490-3295-2-ND; Supplier 2: Digi-Key; Supplier Part Number 2: 445-5192-2-ND; Supplier 3: Digi-Key; Supplier Part Number 3: 587-1250-2-ND; Manufacturer 3: Taiyo Yuden; Manufacturer Part Number 3: EMK107B7474KA-T; Manufacturer 4: Samsung; Manufacturer Part Number 4: CL10B474KONE; ComponentLink1URL: http://psearch.murata.com/capacitor/product/GRM188R71C474KA88#.pdf; ComponentLink1Description: http://psearch.murata.com/capacitor/product/GRM188R71C474KA88#.pdf; ComponentLink2URL: http://product.tdk.com/capacitor/mlcc/en/documents/mlcc_commercial_general_en.pdf; ComponentLink2Description: http://product.tdk.com/capacitor/mlcc/en/documents/mlcc_commercial_general_en.pdf; ComponentLink3URL: http://www.yuden.co.jp/or/product/category/capacitor/EMK107B7474KA-T.pdf; ComponentLink3Description: http://www.yuden.co.jp/or/product/category/capacitor/EMK107B7474KA-T.pdf; Value: 1uf
C78 C84 C86 C91 C93 C96 C98 = CAPC_100n_0603_X7R_50V_10%: as C53 on sheet MC60; Manufacturer 2: TDK Corporation; Manufacturer Part Number 2: C1608X7R1H104K; Package / Case: 0603 (1608 Metric); Tolerance: ±10%; Supplier 1: Digi-Key; Supplier Part Number 1: 478-5052-1-ND; ComponentLink1URL: http://www.avx.com/docs/Catalogs/cx7r.pdf; ComponentLink1Description: http://www.avx.com/docs/Catalogs/cx7r.pdf; Supplier 2: Digi-Key; Supplier Part Number 2: 445-1314-1-ND; ComponentLink2URL: http://product.tdk.com/capacitor/mlcc/en/documents/mlcc_commercial_general_en.pdf; ComponentLink2Description: http://product.tdk.com/capacitor/mlcc/en/documents/mlcc_commercial_general_en.pdf
C79 C81 C92 = CAPC_470n_0603_X7R_16V_10%: Capacitor SMD Cer 100nF 10% 16V X7R 0603; Manufacturer 1: Murata Electronics North America; Manufacturer Part Number 1: GRM188R71C474KA88D; Ratings: 16V; X7R; Material: ceramic; SCDType: spec; Package / Case: 0603 (1608 metric); Tolerance: ±10%; Manufacturer 2: TDK Corporation; Manufacturer Part Number 2: C1608X7R1C474K; Supplier 1: Digi-Key; Supplier Part Number 1: 490-3295-2-ND; Supplier 2: Digi-Key; Supplier Part Number 2: 445-5192-2-ND; Supplier 3: Digi-Key; Supplier Part Number 3: 587-1250-2-ND; Manufacturer 3: Taiyo Yuden; Manufacturer Part Number 3: EMK107B7474KA-T; Manufacturer 4: Samsung; Manufacturer Part Number 4: CL10B474KONE; ComponentLink1URL: http://psearch.murata.com/capacitor/product/GRM188R71C474KA88#.pdf; ComponentLink1Description: http://psearch.murata.com/capacitor/product/GRM188R71C474KA88#.pdf; ComponentLink2URL: http://product.tdk.com/capacitor/mlcc/en/documents/mlcc_commercial_general_en.pdf; ComponentLink2Description: http://product.tdk.com/capacitor/mlcc/en/documents/mlcc_commercial_general_en.pdf; ComponentLink3URL: http://www.yuden.co.jp/or/product/category/capacitor/EMK107B7474KA-T.pdf; ComponentLink3Description: http://www.yuden.co.jp/or/product/category/capacitor/EMK107B7474KA-T.pdf; Value: 100n
C80 C88 C97 = CAPT_330u_2917_6V3: Capacitor SMD Tant 330uF 20% 6V3 2917; Manufacturer Size Code: D; Manufacturer Part Number: T520D337M006ATE015; Ratings: 6.3V; Material: Solid Tantalum; ESR (Equivalent Series Resistance): 15 mOhm; SCDType: spec; Package / Case: 2917 (7343 Metric); Tolerance: ±20%; Operating Temperature: -55°C ~ 125°C; Size / Dimension: 0.287" L x 0.169" W (7.30mm x 4.30mm); Height - Seated (Max): 0.122" (3.10mm); Supplier 1: Digi-Key; Supplier Part Number 1: 399-4052-1-ND; ComponentLink1URL: http://www.kemet.com/datasheets&T520D337M006ATE015; ComponentLink1Description: T520D Datasheet
  C80 C97: Value: 330uf
  C88: Value: 330µ
C82 C87 = CAPC_10u_1206_10V: Capacitor SMD Cer 470nF 10% 10V X5R 1206; Manufacturer 1: KEMET; Manufacturer Part Number 1: C1206C106K8PACTU; Ratings: 10V; X5R; Material: ceramic; SCDType: undef; Package / Case: 1206 (3216 metric); Tolerance: ±10%; Supplier 1: Digi-Key; Supplier Part Number 1: C1206C106K8PACTU-ND
C83 C94 = CAPT_330u_2917_6V3: Capacitor SMD Tant 22uF 20% 6V3 2917; Manufacturer Size Code: D; Manufacturer Part Number: T520D337M006ATE015; Ratings: 6.3V; Material: Solid Tantalum; ESR (Equivalent Series Resistance): 15 mOhm; SCDType: spec; Package / Case: 2917 (7343 Metric); Tolerance: ±20%; Operating Temperature: -55°C ~ 125°C; Size / Dimension: 0.287" L x 0.169" W (7.30mm x 4.30mm); Height - Seated (Max): 0.122" (3.10mm); Supplier 1: Digi-Key; Supplier Part Number 1: 399-4052-1-ND; ComponentLink1URL: http://www.kemet.com/datasheets&T520D337M006ATE015; ComponentLink1Description: T520D Datasheet; Value: 22uf
C85 = CAPT_330u_2917_6V3: Capacitor SMD Tant 4.7uF 20% 6V3 2917; Manufacturer Size Code: D; Manufacturer Part Number: T520D337M006ATE015; Ratings: 6.3V; Material: Solid Tantalum; ESR (Equivalent Series Resistance): 15 mOhm; SCDType: spec; Package / Case: 2917 (7343 Metric); Tolerance: ±20%; Operating Temperature: -55°C ~ 125°C; Size / Dimension: 0.287" L x 0.169" W (7.30mm x 4.30mm); Height - Seated (Max): 0.122" (3.10mm); Supplier 1: Digi-Key; Supplier Part Number 1: 399-4052-1-ND; ComponentLink1URL: http://www.kemet.com/datasheets&T520D337M006ATE015; ComponentLink1Description: T520D Datasheet; Value: 4.7uf
C90 = CAPC_470n_0603_X7R_16V_10%: Capacitor SMD Cer 22nF 10% 16V X7R 0603; Manufacturer 1: Murata Electronics North America; Manufacturer Part Number 1: GRM188R71C474KA88D; Ratings: 16V; X7R; Material: ceramic; SCDType: spec; Package / Case: 0603 (1608 metric); Tolerance: ±10%; Manufacturer 2: TDK Corporation; Manufacturer Part Number 2: C1608X7R1C474K; Supplier 1: Digi-Key; Supplier Part Number 1: 490-3295-2-ND; Supplier 2: Digi-Key; Supplier Part Number 2: 445-5192-2-ND; Supplier 3: Digi-Key; Supplier Part Number 3: 587-1250-2-ND; Manufacturer 3: Taiyo Yuden; Manufacturer Part Number 3: EMK107B7474KA-T; Manufacturer 4: Samsung; Manufacturer Part Number 4: CL10B474KONE; ComponentLink1URL: http://psearch.murata.com/capacitor/product/GRM188R71C474KA88#.pdf; ComponentLink1Description: http://psearch.murata.com/capacitor/product/GRM188R71C474KA88#.pdf; ComponentLink2URL: http://product.tdk.com/capacitor/mlcc/en/documents/mlcc_commercial_general_en.pdf; ComponentLink2Description: http://product.tdk.com/capacitor/mlcc/en/documents/mlcc_commercial_general_en.pdf; ComponentLink3URL: http://www.yuden.co.jp/or/product/category/capacitor/EMK107B7474KA-T.pdf; ComponentLink3Description: http://www.yuden.co.jp/or/product/category/capacitor/EMK107B7474KA-T.pdf; Value: 22n
C95 = CAPC_10u_1206_10V: Capacitor SMD Cer 1uF 10% 10V X5R 1206; Manufacturer 1: KEMET; Manufacturer Part Number 1: C1206C106K8PACTU; Ratings: 10V; X5R; Material: ceramic; SCDType: undef; Package / Case: 1206 (3216 metric); Tolerance: ±10%; Supplier 1: Digi-Key; Supplier Part Number 1: C1206C106K8PACTU-ND
D14 = CMP-07162-000004-1: DIODE SCHOTTKY 60V 3A SMC; Manufacturer: ON Semiconductor; Max Junction Temp: +150°C; Max Surge Forward Current: 100A; Standoff Height: 0.05mm; Peak Reverse Current: 0.5mA; Manufacturer Part Number: SS36; Category: Diode; Device Class L2: Diodes; Lead Free: Yes; Mouser Description: In a Pack of 25, ON Semi 60V 3A, Schottky Diode, 2-Pin DO-214AB SS36; Automotive: No; Package: 403AG; Device Class L3: Schottky Diodes; Footprint Url: https://www.onsemi.com/pub/Collateral/403AG.PDF; Temperature: -55°C to +150°C; ComponentLink2URL: https://www.onsemi.com/pub/Collateral/SS39-D.PDF; Max Repetitive Reverse Voltage: 60V; Octopart: https://octopart.com/ss36-on+semiconductor-84331627; Temperature Range Low: -55°C; Forward Current: 3A; Device Class L1: Discrete Semiconductors; Digikey Description: DIODE SCHOTTKY 60V 3A SMC; RoHS: TRUE; Temperature Range High: +150°C; ComponentLink2Description: Datasheet; Height: 2.65mm
D15 D16 = CMP-2000-04943-2: DIODE SCHOTTKY 40V 1A SMA; Manufacturer: ON Semiconductor; Peak Reverse Current: 0.2mA; Max Junction Temp: +125°C; Standoff Height: 0.05mm; Max Surge Forward Current: 40A; Mouser Description: Schottky Diodes & Rectifiers SMA 40V 1.0A; RoHS: TRUE; Lead Free: Yes; Manufacturer Part Number: SS14; Device Class L3: Schottky Diodes; Category: Diode; Automotive: No; Digikey Description: DIODE SCHOTTKY 40V 1A SMA; ComponentLink2Description: Datasheet; Device Class L2: Diodes; Height: 2.5mm; Temperature Range High: +125°C; ComponentLink2URL: https://www.onsemi.com/pub/Collateral/SS19-D.PDF; Device Class L1: Discrete Semiconductors; Package: 403AE; Octopart: https://octopart.com/ss14-on+semiconductor-29205033; Max Repetitive Reverse Voltage: 40V; Temperature Range Low: -65°C; Forward Current: 1A; Temperature: -65°C to +125°C
D17 = CMP-22017-000008-1: as D10 on sheet MC60; Case Code (Metric): 1608; Packaging: Tape and Reel; Case/Package: 0603; Depth: 1.6mm; Mount: Surface Mount; Lead Free: Lead Free; Min Operating Temperature: -20°C; Lens Transparency: Clear; Illumination Color: Blue; Height: 0.55mm; Test Current: 20mA; Case Code (Imperial): 0603; Max Operating Temperature: 80°C; Number of Pins: 2; Length: 0.8mm; Radiation Hardening: No; Package Quantity: 1; Number of LEDs: 1; Width: 0.8mm; Color: Blue
F1-F3 = CMP-08606-000049-1: PTC RESET FUSE 48V 120MA 1206; Manufacturer: Littelfuse; Manufacturer Part Number: NANOSMDC012F-2; Trip Current: 0.39A; Resistance: 1.4-6.5Ω; Value: 1.4-6.5Ω; Current Rating: 10A; Hold Current: 0.12A; Trip Time: 0.2s; Category: Fuse; Device Class L2: PTC Resettable Fuses; ComponentLink2Description: Datasheet; Automotive: No; Package: nanoSMDC; Ambient Temperature Range Low: -40°C; Lead Free: Yes; Voltage Rating: 48V; Mouser Description: PTC Resettable Fuse 0.12A(hold) 0.39A(trip) 48VDC 10A 0.5W 0.2s 1.4Ohm SMD Solder Pad 1206 T/R Automotive; Octopart: https://octopart.com/nanosmdc012f-2-littelfuse-74215047; Device Class L1: Circuit Protection; Temperature Range High: +85°C; ComponentLink2URL: https://www.littelfuse.com/~/media/electronics/datasheets/resettable_ptcs/littelfuse_ptc_nanosmdc_datasheet.pdf.pdf; Temperature: to +85°C; Height: 1mm; Ambient Temperature Range High: +85°C; Digikey Description: PTC RESET FUSE 48V 120MA 1206; Device Class L3: unset; RoHS: TRUE
IC1 = MIC29302WU: Linear Voltage Regulator IC 1 Output 3A TO-263-5; MF: Microchip Technology; Package: TO-263-6 Microchip Technology; Price: None; MP: MIC29302WU; Availability: Unavailable; SnapEDA_Link: https://www.snapeda.com/parts/MIC29302WU/Microchip/view-part/4422516/?ref=snap; Value: *
L3 = CMP-2000-07148-1: Shielded SMD Power Inductor, 33 uH, +/- 20%, -40 to 125 degC, 2-Pin SMD, RoHS, Tape and Reel; Manufacturer: Bourns; PartNumber: SRR1280; DC Resistance Max: 57MOhm; Maximum Self Resonant Frequency: 9.5MHz; DC Current Max: 3.5A; Inductance: 33000nH; Core Material: Ferrite; Minimum Quality Factor: 28; Maximum DC Resistance: 57mΩ; Datasheet Version: Rev. 03/15, 03/2015; Manufacturer URL: http://www.bourns.com/; Datasheet URL: http://www.bourns.com/docs/Product-Datasheets/SRR1280.pdf; Minimum Operating Temperature: -40°C; Package Description: 2-Pin Surface Mount Device, Body 12.5 x 12.5 mm; Maximum Operating Temperature: +125°C; Tolerance: 20%; Series: SRR1280; Package URL: http://www.bourns.com/docs/Product-Datasheets/SRR1280.pdf; Package Reference: SRR1280-2; Mounting Technology: SurfaceMount; Maximum DC Current: 3.5A
R97 = RES_1K_0603_1%: Resistor SMD chip 47k Ohm 0.1W 1% 0603; Manufacturer 1: Yageo; Manufacturer Part Number 1: RC0603FR-071KL; Ratings: 1/10W; SCDType: spec; Package / Case: 0603 (1608 Metric); Supplier 1: Digi-Key; Supplier Part Number 1: 311-1.00KHRCT-ND
R98 = RES_1K_0603_1%: Resistor SMD chip 1k Ohm 0.1W 1% 0603; Manufacturer 1: Yageo; Manufacturer Part Number 1: RC0603FR-071KL; Ratings: 1/10W; SCDType: spec; Package / Case: 0603 (1608 Metric); Supplier 1: Digi-Key; Supplier Part Number 1: 311-1.00KHRCT-ND
R99 R101 = RES_1K_0603_1%: Resistor SMD chip 43k Ohm 0.1W 1% 0603; Manufacturer 1: Yageo; Manufacturer Part Number 1: RC0603FR-071KL; Ratings: 1/10W; SCDType: spec; Package / Case: 0603 (1608 Metric); Supplier 1: Digi-Key; Supplier Part Number 1: 311-1.00KHRCT-ND
R100 = RES_1K_0603_1%: Resistor SMD chip 75k Ohm 0.1W 1% 0603; Manufacturer 1: Yageo; Manufacturer Part Number 1: RC0603FR-071KL; Ratings: 1/10W; SCDType: spec; Package / Case: 0603 (1608 Metric); Supplier 1: Digi-Key; Supplier Part Number 1: 311-1.00KHRCT-ND
R102 = RES_1K_0603_1%: Resistor SMD chip 10k Ohm 0.1W 1% 0603; Manufacturer 1: Yageo; Manufacturer Part Number 1: RC0603FR-071KL; Ratings: 1/10W; SCDType: spec; Package / Case: 0603 (1608 Metric); Supplier 1: Digi-Key; Supplier Part Number 1: 311-1.00KHRCT-ND
R103 = RES_1K_0603_1%: Resistor SMD chip 100k Ohm 0.1W 1% 0603; Manufacturer 1: Yageo; Manufacturer Part Number 1: RC0603FR-071KL; Ratings: 1/10W; SCDType: spec; Package / Case: 0603 (1608 Metric); Supplier 1: Digi-Key; Supplier Part Number 1: 311-1.00KHRCT-ND
R104 = RES_10R_1206_5%: Resistor SMD chip 470 Ohm 0.25W 5% 1206; Manufacturer 1: Samsung Electro-Mechanics America, Inc; Manufacturer Part Number 1: RC3216J100CS; Ratings: 1/4W; SCDType: spec; Tolerance: ±5%; Package / Case: 1206 (3216 metric); Supplier 1: Digi-Key; Supplier Part Number 1: 1276-5863-1-ND; RoHS 1: RoHS Compliant; ComponentLink1URL: http://www.samsungsem.com/servlet/FileDownload?filename=productcatalog/pdf/Chip_Resistor.pdf; ComponentLink1Description: http://www.samsungsem.com/servlet/FileDownload?filename=productcatalog/pdf/Chip_Resistor.pdf; Supplier 2: Digi-Key; Supplier Part Number 2: 311-10ERCT-ND; Manufacturer 2: Yageo; Manufacturer Part Number 2: RC1206JR-0710RL; RoHS 2: RoHS Compliant; ComponentLink2URL: http://www.yageo.com/documents/recent/PYu-RC1206_51_RoHS_L-4.pdf; ComponentLink2Description: http://www.yageo.com/documents/recent/PYu-RC1206_51_RoHS_L-4.pdf; Supplier 3: Digi-Key; Supplier Part Number 3: RMCF1206JT10R0CT-ND; Manufacturer 3: Stackpole Electronics Inc; Manufacturer Part Number 3: RMCF1206JT10R0; RoHS 3: RoHS Compliant; ComponentLink3URL: http://www.seielect.com/Catalog/SEI-RMCF_RMCP.pdf; ComponentLink3Description: http://www.seielect.com/Catalog/SEI-RMCF_RMCP.pdf; Supplier 4: Digi-Key; Supplier Part Number 4: P10ECT-ND; Manufacturer 4: Panasonic Electronic Components; Manufacturer Part Number 4: ERJ-8GEYJ100V; RoHS 4: RoHS Compliant; ComponentLink4URL: http://industrial.panasonic.com/www-cgi/jvcr13pz.cgi?E+PZ+3+AOA0001+ERJ8GEYJ100V+7+WW; ComponentLink4Description: http://industrial.panasonic.com/www-cgi/jvcr13pz.cgi?E+PZ+3+AOA0001+ERJ8GEYJ100V+7+WW; Supplier 5: Digi-Key; Supplier Part Number 5: RHM10CKCT-ND; Manufacturer 5: Rohm Semiconductor; Manufacturer Part Number 5: MCR18ERTJ100; RoHS 5: RoHS Compliant; ComponentLink5URL: http://rohmfs.rohm.com/en/products/databook/datasheet/passive/resistor/chip_resistor/mcr_g.pdf; ComponentLink5Description: http://rohmfs.rohm.com/en/products/databook/datasheet/passive/resistor/chip_resistor/mcr_g.pdf
U9 U12 = AMS1117: UNO PLUS Arduino R3 Shield, Xbee Arduino IDE Wheeled Robotics Kit; MF: Seeed Technology; Availability: Unavailable; SnapEDA_Link: https://www.snapeda.com/parts/AMS1117/Seeed%20Technology%20Co.%2C%20Ltd/view-part/184428/?ref=snap; MP: AMS1117; Price: None; Value: *; Package: SOT-223 Seeed Technology
U10 = SGM2019: SGM2019 Regulator / Low Power, Low Dropout, / RF-Linear Regulators / TSOT-23 T/R; MP: LT1761ES5-5#TRPBF; MF: Analog Devices; SnapEDA_Link: https://www.snapeda.com/parts/LT1761ES5-5%23TRPBF/Analog%20Devices/view-part/4345495/?ref=snap; Package: SOT-23-5 Analog Devices; Mouser-Purchase-URL: https://snapeda.com/shop?store=Mouser&id=4345495; Arrow_Electronics-Purchase-URL: https://snapeda.com/shop?store=Arrow+Electronics&id=4345495; Digi-Key_Part_Number: LT1761ES5-5#TRPBFCT-ND; DigiKey-Purchase-URL: https://snapeda.com/shop?store=DigiKey&id=4345495; Value: *
U11 = CMP-2000-06545-1: Simple Switcher(R) Power Converter 150 kHz Step-Down Voltage Regulator, 3 A, 4.5 to 40 V, -40 to 125 degC, 5-Pin TO-263 (KTT), Green (RoHS & no Sb/Br), Tape and Reel; PartNumber: LM2596; Manufacturer: Texas Instruments; Package Version: 4200577-4/G, 01/2013; Primary Input Voltage: 40V; No. of Outputs: 1; No. of Pins: 5; SVHC: NoSVHC(19-Dec-2012); Output Voltage: 37V; Output Current: 3A; Datasheet Version: Rev. C, 04/2013; Package Reference: KTT5; MSL: MSL3-168hours; Number of Outputs: 1; Operating Temperature Min: -40°C; Operating Temperature Range: -40°Cto+125°C; Manufacturer URL: http://www.ti.com/; Package URL: http://www.ti.com/litv/pdf/mpsf007e; Voltage Regulator Case Style: TO-263; Operating Temperature Max: 125°C; Package Description: 5-Pin Plastic Flange Mount, Body 10.16 x 8.925 mm, Pitch 1.7 mm; Datasheet URL: http://www.ti.com/lit/ds/symlink/lm2596.pdf; Mounting Technology: SurfaceMount
X1 = Phoenix MKDSN 02: DatasheetVersion: 2021; ComponentLink1Description: Website Smart World; ComponentLink1URL: https://www.smartw.ir/; ComponentLink2Description: Telegram; ComponentLink2URL: https://t.me/altium_smartw; ComponentLink3Description: Instagram; ComponentLink3URL: https://Instagram.com/smartgw.ir

## Sheet MCU4.SchDoc
size A4; SheetNumber: 7; SheetTotal: 8
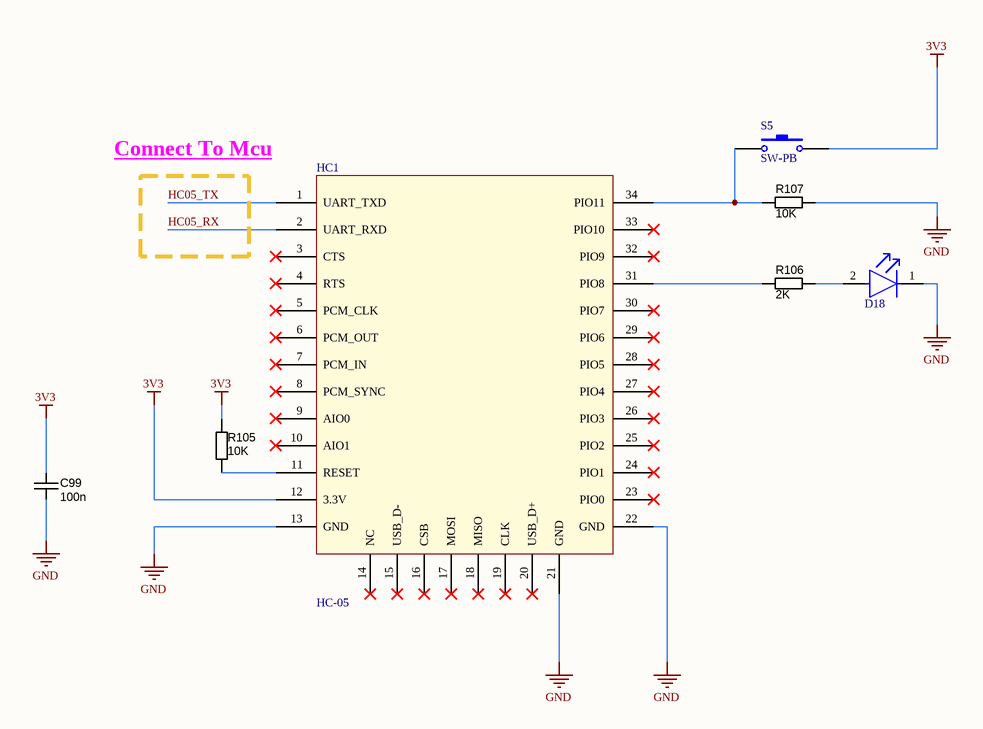
[diagram p7: MCU4.SchDoc]

### Parts
C99  value 100n  [CAPC1608X90N]  (hidden comment: approved sub OK)
D18  LTST-C191TBKT  [FP-LTST-C191TBKT-MFG]  (value not drawn)
HC1  HC-05  [HC-05]
R105  value 10K  [RESC1608X55N]  (hidden comment: Thick Film)
R106  value 2K  [RESC1608X55N]  (hidden comment: Thick Film)
R107  value 10K  [RESC1608X55N]  (hidden comment: Thick Film)
S5  SW-PB  [SWPBS_SPST_6X3X5]

### Nets
3V3: C99.1 HC1.12(3.3V) R105.2 S5.1
GND: C99.2 D18.1(C) HC1.13(GND) HC1.21(GND) HC1.22(GND) R107.2
HC05_RX: HC1.2(UART_RXD)
HC05_TX: HC1.1(UART_TXD)
NetD18_2: D18.2(A) R106.2
NetHC1_11: HC1.11(RESET) R105.1
NetHC1_31: HC1.31(PIO8) R106.1
NetHC1_34: HC1.34(PIO11) R107.1 S5.2

Not connected (* = marked no-connect by the designer): HC1 3(CTS)* 4(RTS)* 5(PCM_CLK)* 6(PCM_OUT)* 7(PCM_IN)* 8(PCM_SYNC)* 9(AIO0)* 10(AIO1)* 14(NC)* 15(USB_D-)* 16(CSB)* 17(MOSI)* 18(MISO)* 19(CLK)* 20(USB_D+)* 23(PIO0)* 24(PIO1)* 25(PIO2)* 26(PIO3)* 27(PIO4)* 28(PIO5)* 29(PIO6)* 30(PIO7)* 32(PIO9)* 33(PIO10)*

### Notes on the sheet
- Connect To Mcu

### Library data of the parts
C99 = CAPC_100n_0603_X7R_50V_10%: as C53 on sheet MC60; Manufacturer 2: TDK Corporation; Manufacturer Part Number 2: C1608X7R1H104K; Package / Case: 0603 (1608 Metric); Tolerance: ±10%; Supplier 1: Digi-Key; Supplier Part Number 1: 478-5052-1-ND; ComponentLink1URL: http://www.avx.com/docs/Catalogs/cx7r.pdf; ComponentLink1Description: http://www.avx.com/docs/Catalogs/cx7r.pdf; Supplier 2: Digi-Key; Supplier Part Number 2: 445-1314-1-ND; ComponentLink2URL: http://product.tdk.com/capacitor/mlcc/en/documents/mlcc_commercial_general_en.pdf; ComponentLink2Description: http://product.tdk.com/capacitor/mlcc/en/documents/mlcc_commercial_general_en.pdf
D18 = CMP-22017-000008-1: as D10 on sheet MC60; Case Code (Metric): 1608; Packaging: Tape and Reel; Case/Package: 0603; Depth: 1.6mm; Mount: Surface Mount; Lead Free: Lead Free; Min Operating Temperature: -20°C; Lens Transparency: Clear; Illumination Color: Blue; Height: 0.55mm; Test Current: 20mA; Case Code (Imperial): 0603; Max Operating Temperature: 80°C; Number of Pins: 2; Length: 0.8mm; Radiation Hardening: No; Package Quantity: 1; Number of LEDs: 1; Width: 0.8mm; Color: Blue
HC1 = HC-05: HC serial Bluetooth products consist of Bluetooth serial interface module and Bluetooth adapter, such; ComponentLink1Description: Website Smart World; ComponentLink1URL: https://www.smartw.ir/; ComponentLink2Description: Telegram; ComponentLink2URL: https://t.me/altium_smartw; ComponentLink3Description: Instagram; ComponentLink3URL: https://Instagram.com/smartgw.ir; DatasheetVersion: 2021
R105 R107 = RES_4K7_0603_5%: Resistor SMD chip 10k Ohm 0.1W 5% 0603; Manufacturer 1: Vishay/Dale; Manufacturer Part Number 1: CRCW06034K70JNEA; Ratings: 1/10 W; SCDType: spec; Package / Case: 0603 (1608 metric); Tolerance: ±5%; Material: Thick Film; Supplier 1: Digi-Key; Supplier Part Number 1: 541-4.7KGCT-ND
R106 = RES_4K7_0603_5%: Resistor SMD chip 2k Ohm 0.1W 5% 0603; Manufacturer 1: Vishay/Dale; Manufacturer Part Number 1: CRCW06034K70JNEA; Ratings: 1/10 W; SCDType: spec; Package / Case: 0603 (1608 metric); Tolerance: ±5%; Material: Thick Film; Supplier 1: Digi-Key; Supplier Part Number 1: 541-4.7KGCT-ND
S5 = SW-PB: Switch; Published: 24-Mar-1999; LatestRevisionDate: 17-Jul-2002; LatestRevisionNote: Re-released for DXP Platform.; PackageReference: SPST-2; Publisher: Altium Limited; PackageDescription: Switch; 2 Leads